# EAGLE design W25X40_BREAKOUT (EAGLE 7.4.0)
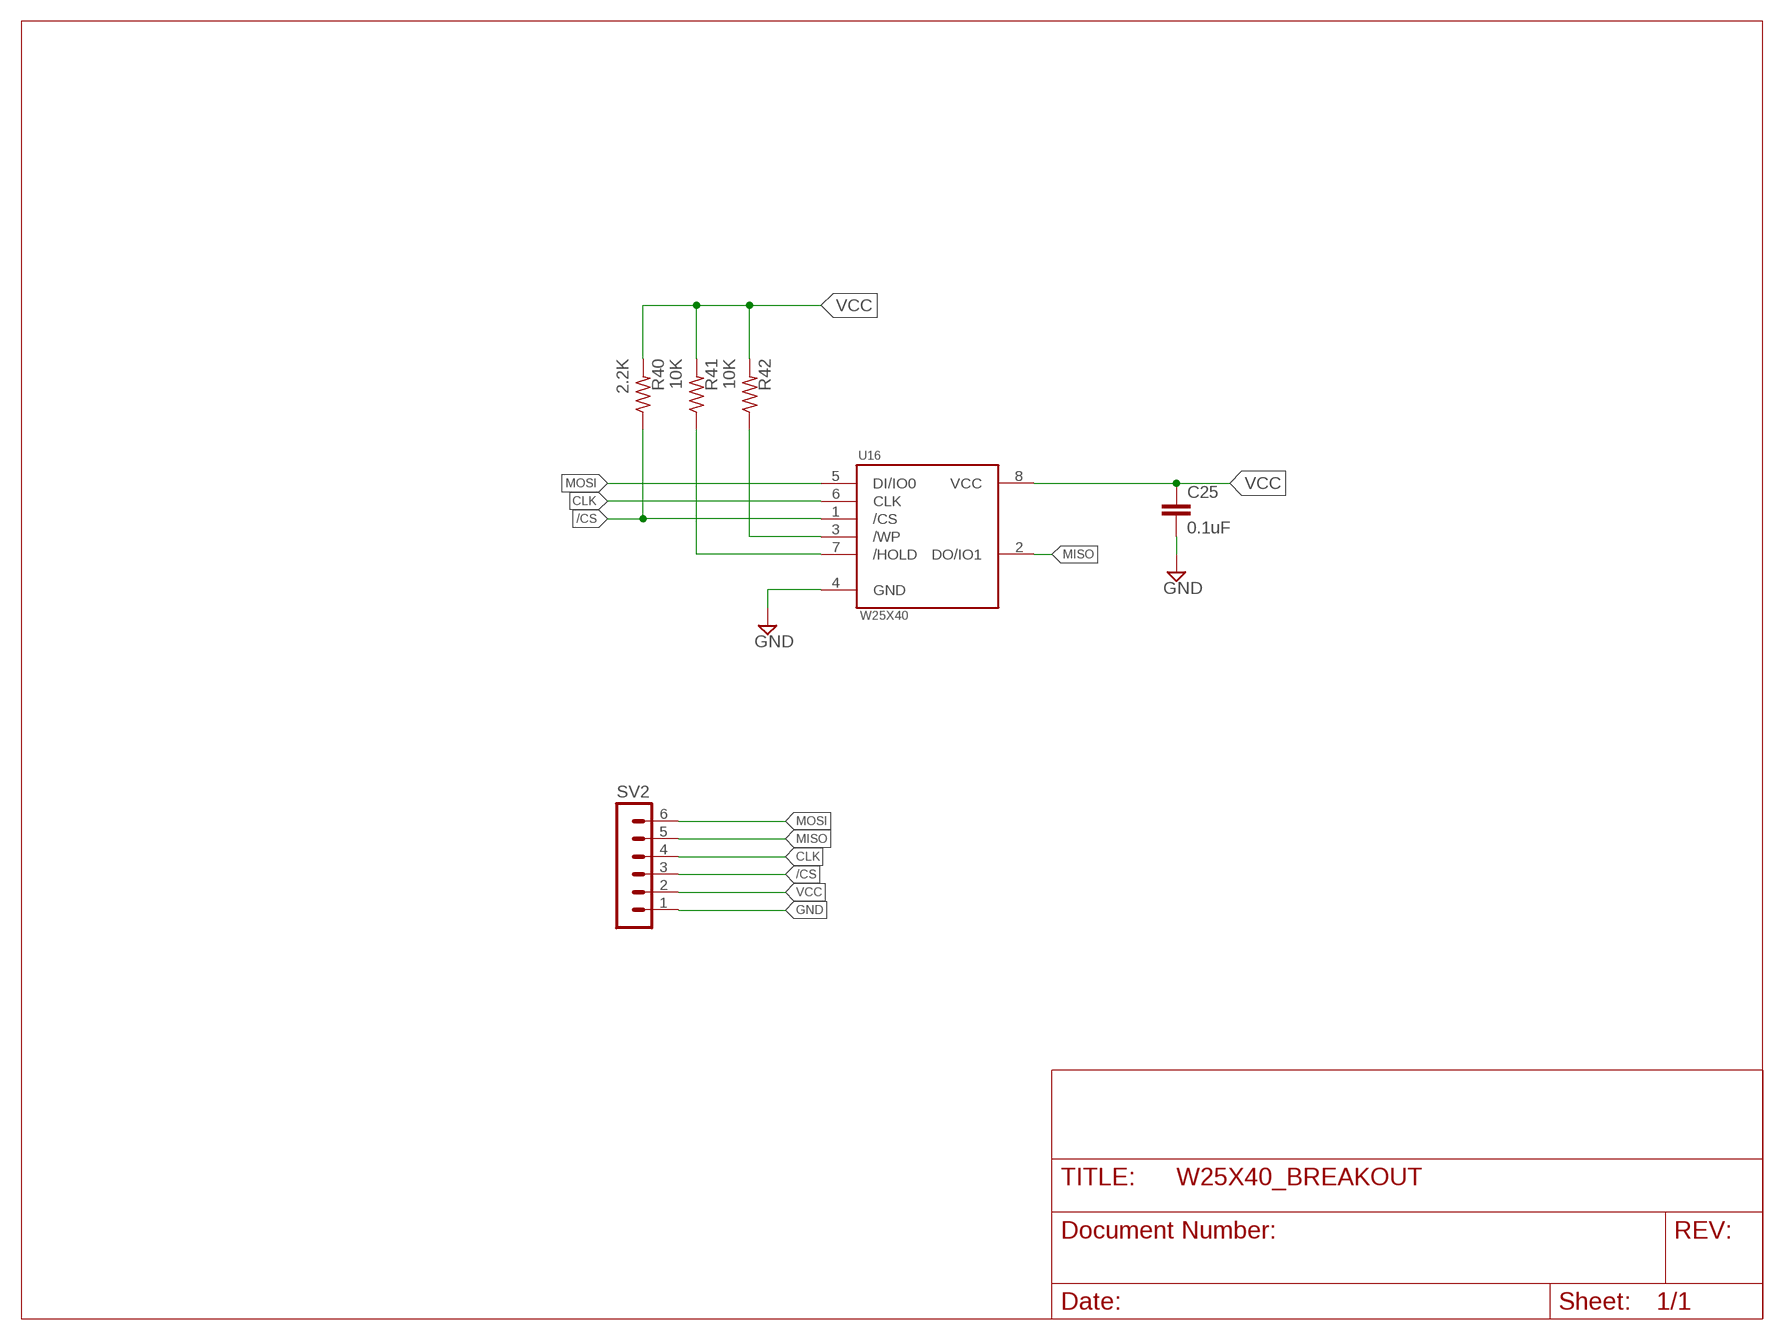
[diagram p0: schematic, sheet 1]

## Parts
C25  0.1uF  C-EU025-030X050  [C025-030X050]
R40  2.2K  R-EU_0204/7  [0204/7]
R41  10K  R-EU_0204/7  [0204/7]
R42  10K  R-EU_0204/7  [0204/7]
SV2  MA06-1  [MA06-1]
U16  W25X40CLUXIG  [SOIC8]

## Nets
/CS: R40.1 SV2.3 U16.1(/CS)
CLK: SV2.4 U16.6(CLK)
GND: C25.2 SV2.1 U16.4(GND)
MISO: SV2.5 U16.2(DO/IO1)
MOSI: SV2.6 U16.5(DI/IO0)
N$24: R41.1 U16.7(/HOLD)
N$29: R42.1 U16.3(/WP)
VCC: C25.1 R40.2 R41.2 R42.2 SV2.2 U16.8(VCC)

## Library data of the parts
C25 = rcl:C-EU: CAPACITOR, European symbol
R40-R42 = rcl:R-EU_: RESISTOR, European symbol
SV2 = con-lstb:MA06-1: PIN HEADER; OC_FARNELL: unknown; OC_NEWARK: unknown
U16 = DribletComponents:W25X40CLUXIG: IC FLASH 4MBIT 104MHZ

## Board
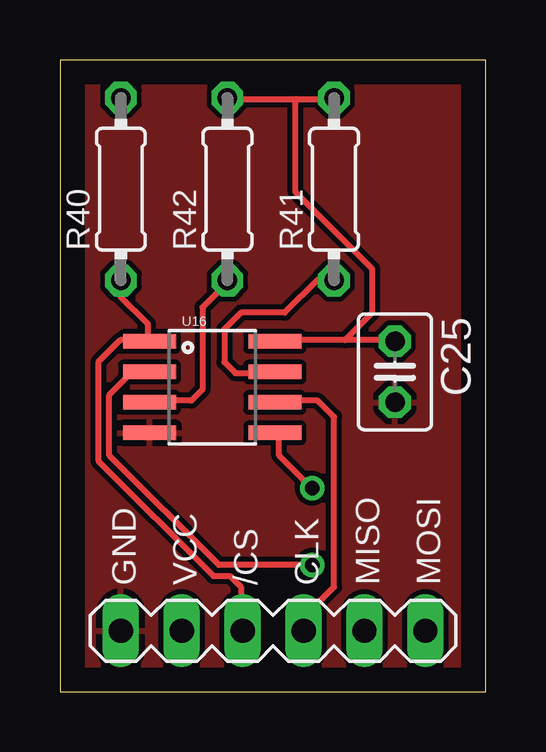
[diagram p1: board, top side]
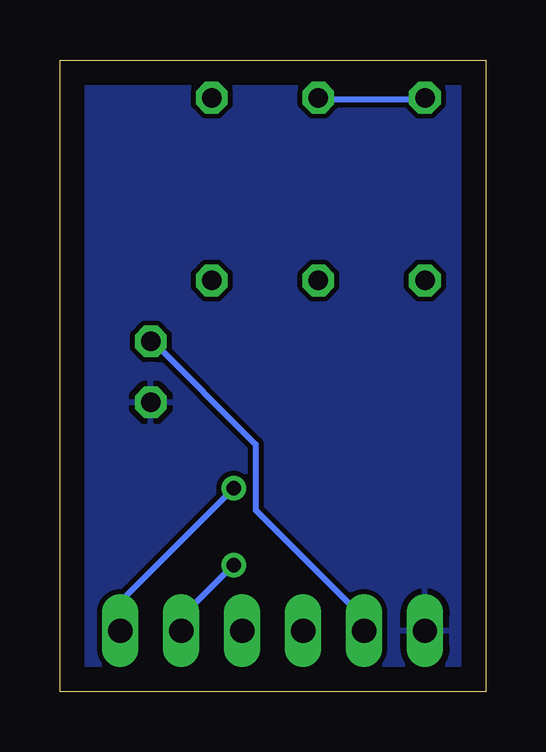
[diagram p2: board, bottom side, seen from below]

Size 17.76 x 26.34 mm. Coordinates in mm from the lower left corner, seen from the top.
Outline: 0,0 17.76,0 17.76,26.34 0,26.34 0,0
Copper layers (1*16): Top 0.035mm / dielectric 1.5mm / Bottom 0.035mm
Design rules "default": minimum track width 10mil, minimum drill 24mil, track to track 8mil, track to pad 8mil, pad to pad 8mil, via to via 8mil, smd to smd 8mil, copper to edge 40mil, drill to drill 8mil, minimum pad ring 10mil, minimum via ring 8mil, stop-mask expansion 4mil, vias tented up to drill 0mil, thermal gap 10mil

### Footprints (pad centres in the part's own frame; a part is rotated, then mirrored left to right if it is on the bottom)
C025-030X050 = drill 0.813 octagon: 1 -1.27,0; 2 1.27,0
0204/7 = drill 0.813 octagon: 1 -3.81,0; 2 3.81,0
MA06-1 = drill 1.016 long: 1 -6.35,0; 2 -3.81,0; 3 -1.27,0; 4 1.27,0; 5 3.81,0; 6 6.35,0
SOIC8 = smd 2.21 x 0.61: 1 -2.616,1.905; 2 -2.616,0.635; 3 -2.616,-0.635; 4 -2.616,-1.905; 5 2.616,-1.905; 6 2.616,-0.635; 7 2.616,0.635; 8 2.616,1.905

### Placement (x,y rotation side)
C25  13.97,13.34 270 top
R40  2.54,20.95 90 top
R41  11.43,20.95 90 top
R42  6.99,20.95 90 top
SV2  8.89,2.54 0 top
U16  6.35,12.7 0 top

### Tracks (layer width: path | path; a pad name or v marks a point on that pad's centre or on a via)
/CS
  Top 0.254: 3.66,14.66 3.66,15.34 2.52,16.48 2.52,16.94 R40.1 | 3.66,14.66 2.52,14.66 1.6,13.74 1.6,9.63 6.4,4.83 7.09,4.83 7.54,4.37 7.54,2.54 SV2.3 | 3.66,14.66 U16.1
CLK
  Top 0.254: U16.6 9.14,12.14 10.74,12.14 11.43,11.45 11.43,4.37 10.29,3.23 10.29,2.54 SV2.4
GND
  pour Top: 0,26.04 17.78,26.04 17.78,0 0,0
  pour Bottom: 0,26.04 17.78,26.04 17.78,0 0,0
MISO  (via drill 0.61)
  Top 0.254: v10.52,5.28 6.63,5.28 2.06,9.86 2.06,12.37 2.97,13.28 3.66,13.28 U16.2
  Bottom 0.254: v10.52,5.28 12.57,3.23 12.57,2.54 SV2.5
MOSI  (via drill 0.61)
  Top 0.254: v10.52,8.48 9.14,9.86 9.14,10.77 U16.5
  Bottom 0.254: v10.52,8.48 15.09,3.91 15.09,2.54 SV2.6
N$24
  Top 0.254: U16.7 8.91,13.28 7.32,13.28 6.86,13.74 6.86,15.11 7.54,15.8 9.37,15.8 10.74,17.17 11.43,17.17 R41.1
N$29
  Top 0.254: U16.3 3.89,12.14 5.49,12.14 5.94,12.6 5.94,16.03 6.63,16.71 6.63,16.94 6.86,17.17 R42.1
VCC
  Top 0.254: 9.83,24.71 7.09,24.71 R42.2 | 9.83,24.71 11.43,24.71 R41.2 | 11.89,14.66 13.95,14.66 C25.1 | 11.89,14.66 9.14,14.66 U16.8 | 9.83,24.71 9.83,20.83 13.03,17.63 13.03,15.8 11.89,14.66
  Bottom 0.254: R40.2 2.74,24.71 6.86,24.71 R42.2 | SV2.2 5.26,2.54 5.26,3.23 9.6,7.57 9.6,10.31 13.95,14.66 C25.1

### Text on the board
tNames: GND | VCC | /CS | CLK | MISO | MOSI